# Altium schematic sheet Top_Level.SchDoc
size B; SheetNumber: 1; SheetTotal: 10
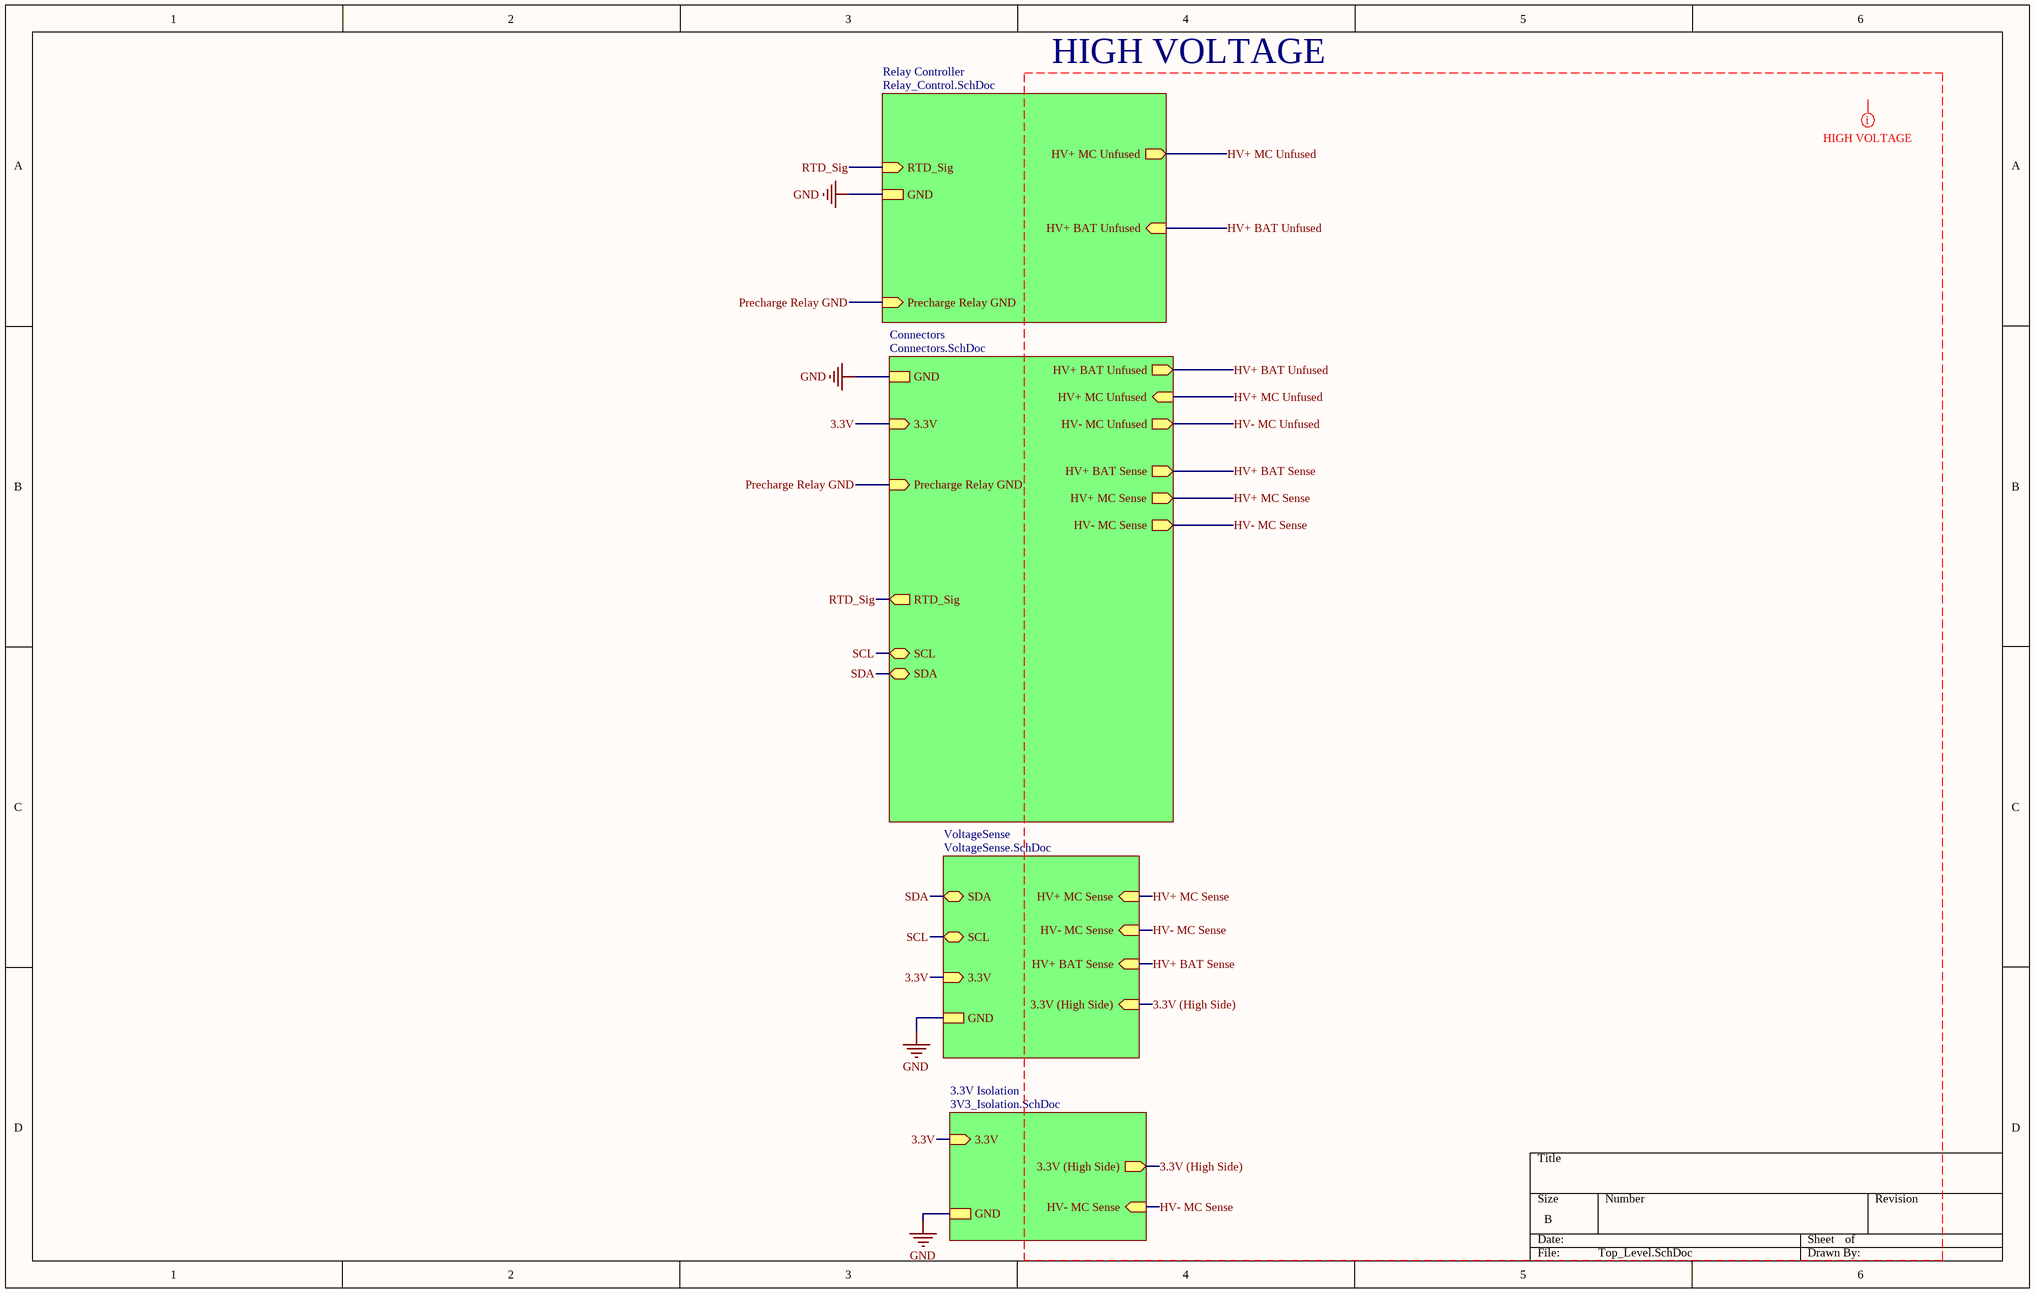
[diagram p0: Top_Level.SchDoc]

## Sub-sheets
3.3V Isolation = 3V3_Isolation.SchDoc: GND, 3.3V (in), 3.3V (High Side) (out), HV- MC Sense (in)
Connectors = Connectors.SchDoc: GND, Precharge Relay GND (in), HV+ BAT Unfused (out), HV+ MC Unfused (in), HV- MC Unfused (out), 3.3V (in), RTD_Sig (out), SCL (bidir), SDA (bidir), HV+ BAT Sense (out), HV+ MC Sense (out), HV- MC Sense (out)
Relay Controller = Relay_Control.SchDoc: RTD_Sig (in), GND, Precharge Relay GND (in), HV+ MC Unfused (out), HV+ BAT Unfused (in)
VoltageSense = VoltageSense.SchDoc: HV+ MC Sense (in), HV- MC Sense (in), 3.3V (in), SDA (bidir), SCL (bidir), GND, 3.3V (High Side) (in), HV+ BAT Sense (in)

## Nets
GND: sheet Relay Controller/GND, sheet Connectors/GND, sheet VoltageSense/GND, sheet 3.3V Isolation/GND
3.3V: sheet Connectors/3.3V, sheet VoltageSense/3.3V, sheet 3.3V Isolation/3.3V
3.3V (High Side): sheet VoltageSense/3.3V (High Side), sheet 3.3V Isolation/3.3V (High Side)
HV+ BAT Sense: sheet Connectors/HV+ BAT Sense, sheet VoltageSense/HV+ BAT Sense
HV+ BAT Unfused: sheet Relay Controller/HV+ BAT Unfused, sheet Connectors/HV+ BAT Unfused
HV+ MC Sense: sheet Connectors/HV+ MC Sense, sheet VoltageSense/HV+ MC Sense
HV+ MC Unfused: sheet Relay Controller/HV+ MC Unfused, sheet Connectors/HV+ MC Unfused
HV- MC Sense: sheet Connectors/HV- MC Sense, sheet VoltageSense/HV- MC Sense, sheet 3.3V Isolation/HV- MC Sense
HV- MC Unfused: sheet Connectors/HV- MC Unfused
Precharge Relay GND: sheet Relay Controller/Precharge Relay GND, sheet Connectors/Precharge Relay GND
RTD_Sig: sheet Relay Controller/RTD_Sig, sheet Connectors/RTD_Sig
SCL: sheet Connectors/SCL, sheet VoltageSense/SCL
SDA: sheet Connectors/SDA, sheet VoltageSense/SDA

## Layout directives
mark named HIGH VOLTAGE: 3.3V (High Side), HV+ BAT Sense, HV+ BAT Unfused, HV+ MC Sense, HV+ MC Unfused, HV- MC Sense, HV- MC Unfused

## Notes on the sheet
- HIGH VOLTAGE